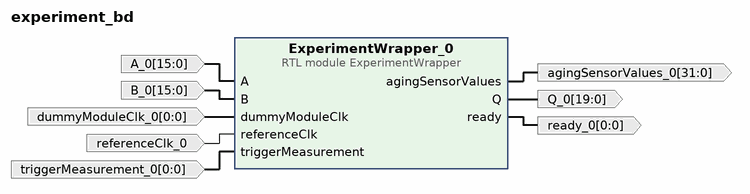
[diagram p0: block diagram of the top level]
# Vivado block design experiment_bd, xc7a100tcsg324-1, Vivado 2020.1
create_bd_design experiment_bd

create_bd_port -dir I -from 15 -to 0 A_0
create_bd_port -dir I -from 15 -to 0 B_0
create_bd_port -dir O -from 19 -to 0 Q_0
create_bd_port -dir O -from 31 -to 0 agingSensorValues_0
create_bd_port -dir I -from 0 -to 0 dummyModuleClk_0
create_bd_port -dir O -from 0 -to 0 ready_0
create_bd_port -dir I referenceClk_0
create_bd_port -dir I -from 0 -to 0 triggerMeasurement_0

create_bd_cell -type module -reference ExperimentWrapper ExperimentWrapper_0

# ---- connections ----

connect_bd_net -net A_0_1 [get_bd_ports A_0] [get_bd_pins ExperimentWrapper_0/A]
connect_bd_net -net B_0_1 [get_bd_ports B_0] [get_bd_pins ExperimentWrapper_0/B]
connect_bd_net [get_bd_pins ExperimentWrapper_0/Q] [get_bd_ports Q_0]
connect_bd_net [get_bd_pins ExperimentWrapper_0/agingSensorValues] [get_bd_ports agingSensorValues_0]
connect_bd_net -net dummyModuleClk_0_1 [get_bd_ports dummyModuleClk_0] [get_bd_pins ExperimentWrapper_0/dummyModuleClk]
connect_bd_net [get_bd_pins ExperimentWrapper_0/ready] [get_bd_ports ready_0]
connect_bd_net -net referenceClk_0_1 [get_bd_ports referenceClk_0] [get_bd_pins ExperimentWrapper_0/referenceClk]
connect_bd_net -net triggerMeasurement_0_1 [get_bd_ports triggerMeasurement_0] [get_bd_pins ExperimentWrapper_0/triggerMeasurement]

validate_bd_design
save_bd_design
